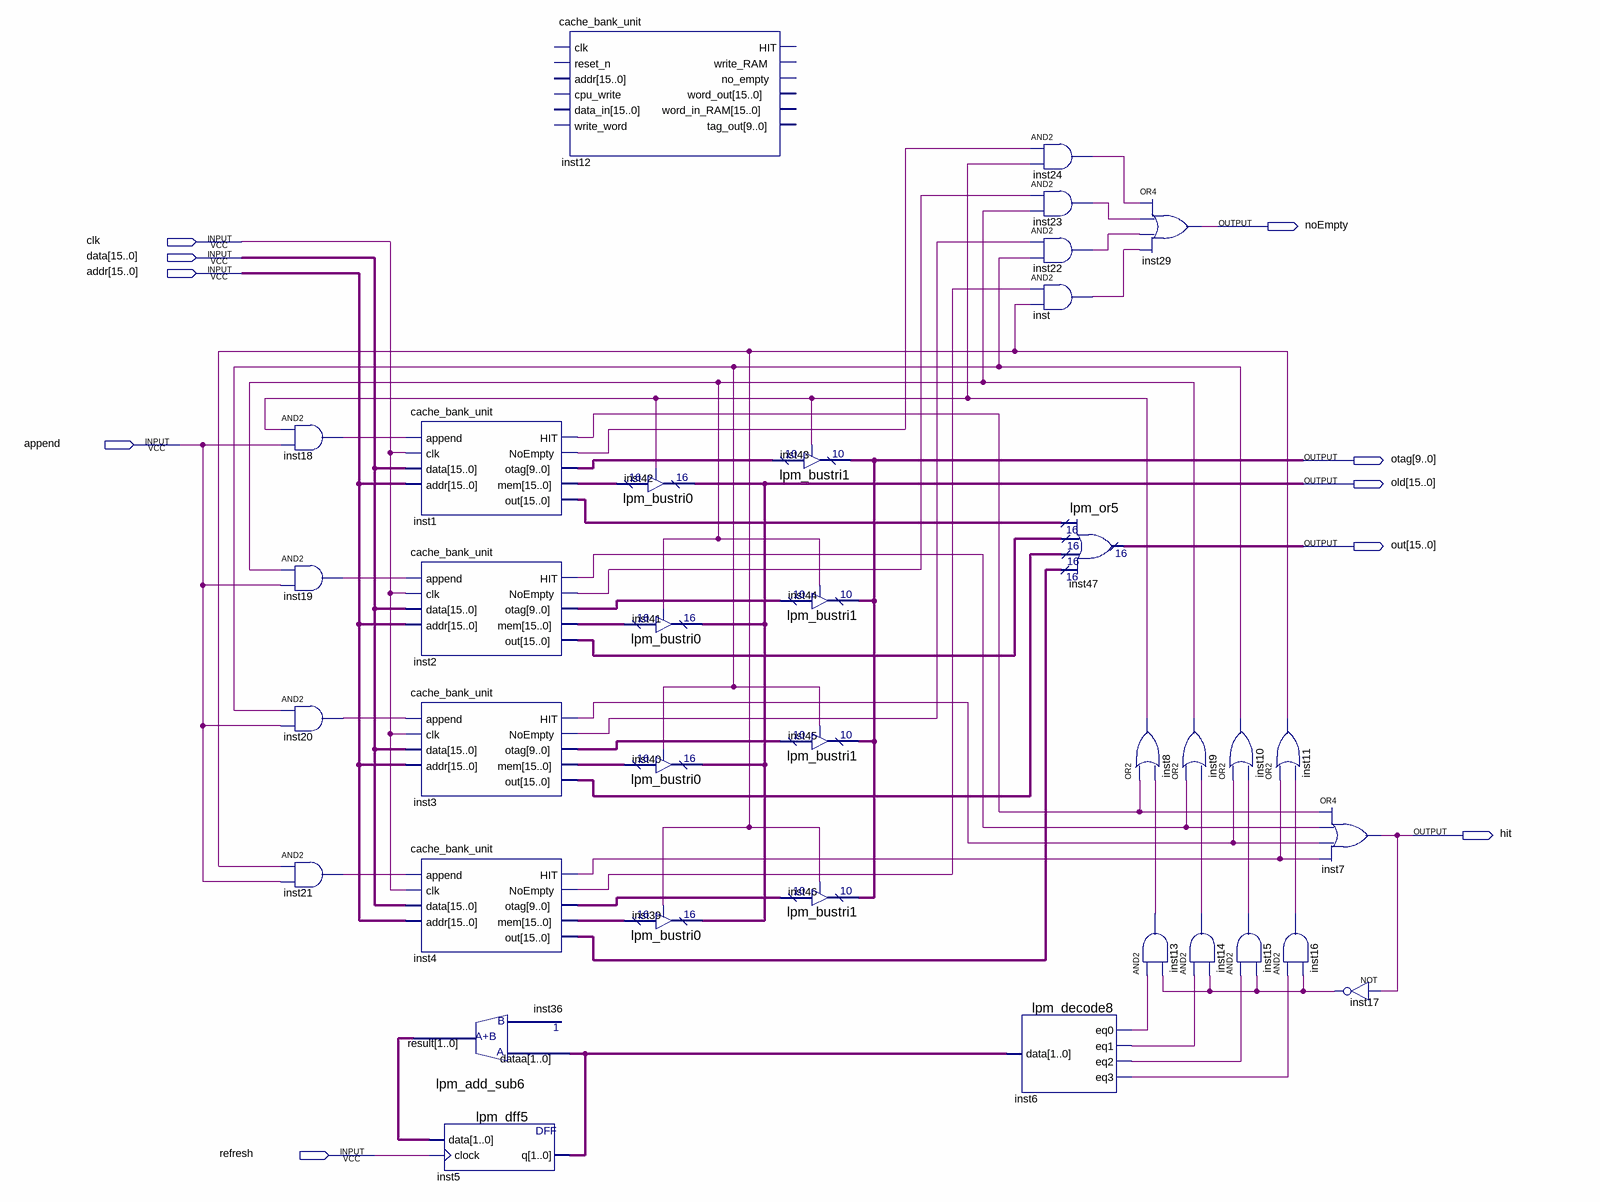
[diagram p0: schematic sheet]
// Quartus schematic cache_unit.bdf as structural Verilog: 36 symbols, 10 pins
module cache_unit (
  input  clk,
  input  [15:0] data,
  input  [15:0] addr,
  input  append,
  input  refresh,
  output noEmpty,
  output [9:0] otag,
  output [15:0] old,
  output [15:0] out,
  output hit
);

  wire inst1_hit, inst1_noempty, inst2_hit, inst2_noempty, inst3_hit, inst3_noempty, inst4_hit,
       inst4_noempty, inst6_eq0, inst6_eq1, inst6_eq2, inst6_eq3, inst8_out, inst9_out, inst10_out,
       inst11_out, inst13_out, inst14_out, inst15_out, inst16_out, inst17_out, inst18_out, inst19_out,
       inst20_out, inst21_out, inst22_out, inst23_out, inst24_out, inst_out;
  wire [1:0] inst5_q, inst36_result;
  wire [9:0] inst1_otag, inst2_otag, inst3_otag, inst4_otag;
  wire [15:0] inst1_mem, inst1_out, inst2_mem, inst2_out, inst3_mem, inst3_out, inst4_mem, inst4_out;

  and inst18 (inst18_out, inst8_out, append);
  and inst19 (inst19_out, inst9_out, append);
  and inst20 (inst20_out, inst10_out, append);
  and inst21 (inst21_out, inst11_out, append);
  cache_bank_unit inst1 (
    .append(inst18_out), .clk(clk), .data(data), .addr(addr), .HIT(inst1_hit), .NoEmpty(inst1_noempty),
    .otag(inst1_otag), .mem(inst1_mem), .out(inst1_out));
  cache_bank_unit inst2 (
    .append(inst19_out), .clk(clk), .data(data), .addr(addr), .HIT(inst2_hit), .NoEmpty(inst2_noempty),
    .otag(inst2_otag), .mem(inst2_mem), .out(inst2_out));
  cache_bank_unit inst3 (
    .append(inst20_out), .clk(clk), .data(data), .addr(addr), .HIT(inst3_hit), .NoEmpty(inst3_noempty),
    .otag(inst3_otag), .mem(inst3_mem), .out(inst3_out));
  cache_bank_unit inst4 (
    .append(inst21_out), .clk(clk), .data(data), .addr(addr), .HIT(inst4_hit), .NoEmpty(inst4_noempty),
    .otag(inst4_otag), .mem(inst4_mem), .out(inst4_out));
  lpm_add_sub6 inst36 (.dataa(inst5_q), .result(inst36_result));
  lpm_dff5 inst5 (.data(inst36_result), .clock(refresh), .q(inst5_q));
  cache_bank_unit inst12 ();  // open: clk, reset_n, addr, cpu_write, data_in, write_word, HIT, write_RAM, no_empty, word_out, word_in_RAM, tag_out
  lpm_bustri0 inst42 (.enabledt(inst8_out), .data(inst1_mem), .tridata(old));
  lpm_bustri0 inst41 (.enabledt(inst9_out), .data(inst2_mem), .tridata(old));
  lpm_bustri0 inst40 (.enabledt(inst10_out), .data(inst3_mem), .tridata(old));
  lpm_bustri0 inst39 (.enabledt(inst11_out), .data(inst4_mem), .tridata(old));
  lpm_bustri1 inst43 (.enabledt(inst8_out), .data(inst1_otag), .tridata(otag));
  lpm_bustri1 inst44 (.enabledt(inst9_out), .data(inst2_otag), .tridata(otag));
  lpm_bustri1 inst45 (.enabledt(inst10_out), .data(inst3_otag), .tridata(otag));
  lpm_bustri1 inst46 (.enabledt(inst11_out), .data(inst4_otag), .tridata(otag));
  lpm_decode8 inst6 (.data(inst5_q), .eq0(inst6_eq0), .eq1(inst6_eq1), .eq2(inst6_eq2), .eq3(inst6_eq3));
  and inst24 (inst24_out, inst1_noempty, inst8_out);
  and inst23 (inst23_out, inst2_noempty, inst9_out);
  and inst22 (inst22_out, inst3_noempty, inst10_out);
  and inst (inst_out, inst4_noempty, inst11_out);
  lpm_or5 inst47 (.data0x(inst1_out), .data1x(inst2_out), .data2x(inst3_out), .data3x(inst4_out), .result(out));
  or inst29 (noEmpty, inst24_out, inst23_out, inst22_out, inst_out);
  or inst8 (inst8_out, inst1_hit, inst13_out);
  and inst13 (inst13_out, inst6_eq0, inst17_out);
  or inst9 (inst9_out, inst2_hit, inst14_out);
  and inst14 (inst14_out, inst6_eq1, inst17_out);
  or inst10 (inst10_out, inst3_hit, inst15_out);
  or inst11 (inst11_out, inst4_hit, inst16_out);
  and inst15 (inst15_out, inst6_eq2, inst17_out);
  or inst7 (hit, inst1_hit, inst2_hit, inst3_hit, inst4_hit);
  and inst16 (inst16_out, inst6_eq3, inst17_out);
  not inst17 (inst17_out, hit);
endmodule
